# Altium project sim.PRJPCB
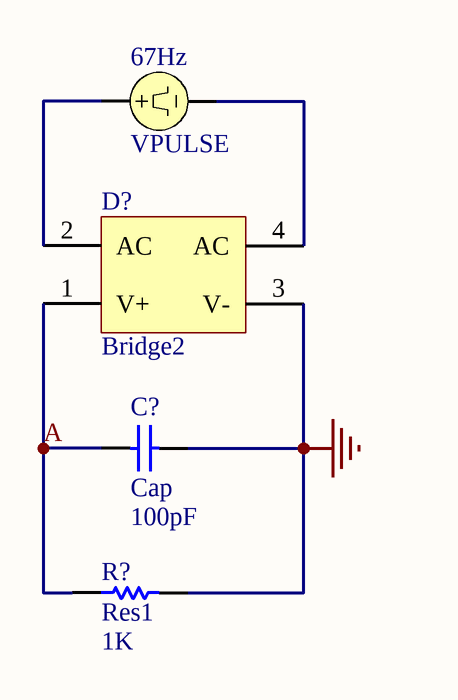
[diagram p0: sim.SCHDOC]
1 sheet, 4 parts. Net scope: global (net labels, ports and power ports of the same name join across sheets).

## Sheet sim.SCHDOC
size A4

### Parts
67Hz  VPULSE
C?  Cap  value 100pF  [RAD-0.3]
D?  Bridge2  [E-BIP-P4/X2.1]
R?  Res1  value 1K  [AXIAL-0.3]

### Nets
GND: C?.2 D?.3(V-) R?.2
A: C?.1 D?.1(V+) R?.1
Net67Hz_1: 67Hz.1 D?.2(AC)
Net67Hz_2: 67Hz.2 D?.4(AC)

### Library data of the parts
67Hz = VPULSE: Pulse Voltage Source; Manufacturer: Generic Components; Class: Simulation; Note: PCB Footprint - Not required; Published: 8/06/2000; Publisher: Altium Hobart Technology Centre; Sub-Class: Voltage Source
C? = Cap: Capacitor; Published: 8-Jun-2000; Revision: July-2002: Re-released for DXP Platform.; Publisher: Altium Limited
D? = Bridge2: Diode Bridge; Published: 24-Mar-1999; Revision: July-2002: Re-released for DXP Platform.; Publisher: Altium Limited
R? = Res1: Resistor; Published: 8-Jun-2000; Revision: July-2002: Re-released for DXP Platform.; Publisher: Altium Limited